# EAGLE design delayed_lfo (EAGLE 7.4.0)

## Sheet 1 of 2
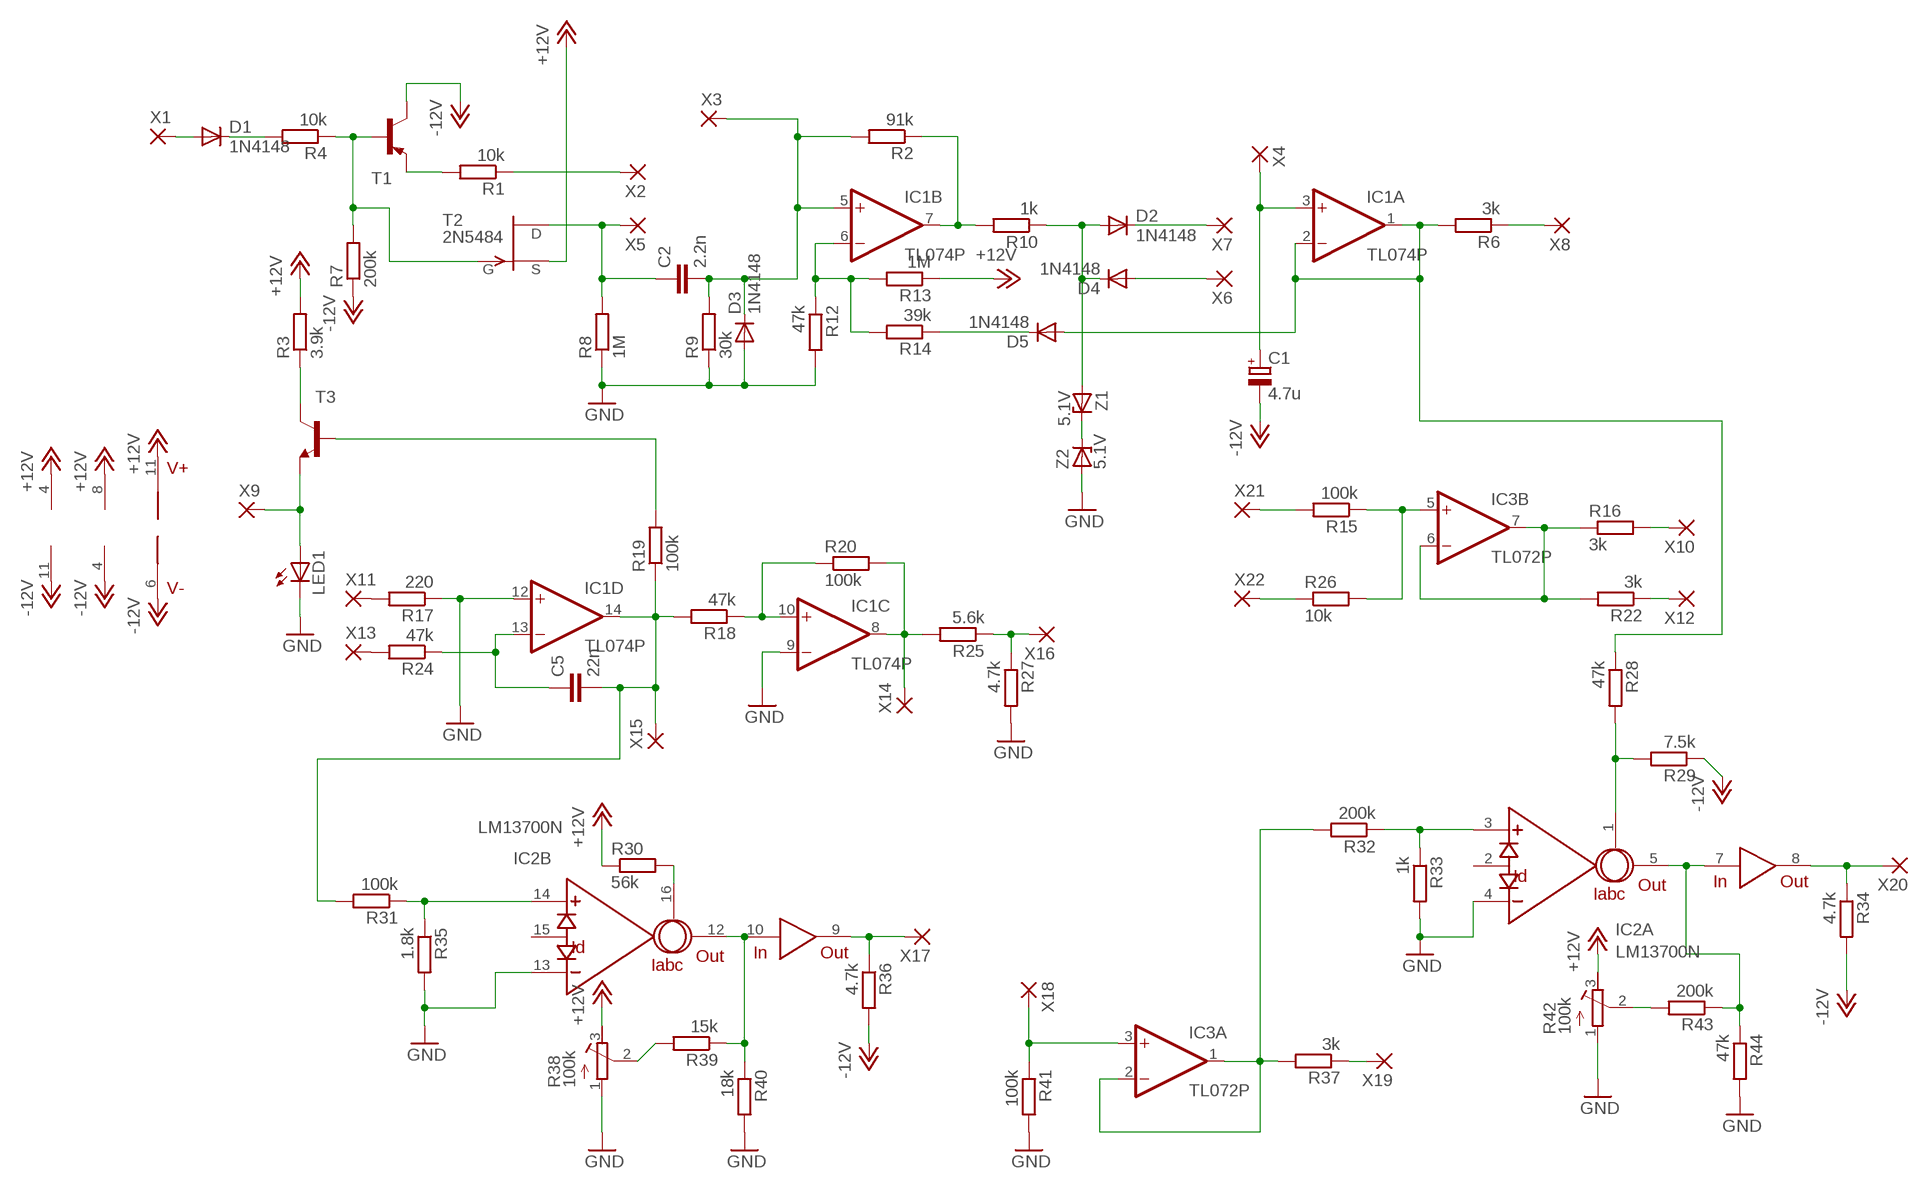
[diagram p0: schematic, sheet 1]

### Parts
C1  4.7u  CPOL-EUE2-5  [E2-5]
C2  2.2n  C-EU050-035X075  [C050-035X075]
C5  22n  C-EU050-035X075  [C050-035X075]
D1  1N4148  1N4148DO35-7  [DO35-7]
D2  1N4148  1N4148DO35-7  [DO35-7]
D3  1N4148  1N4148DO35-7  [DO35-7]
D4  1N4148  1N4148DO35-7  [DO35-7]
D5  1N4148  1N4148DO35-7  [DO35-7]
IC1  TL074P  [DIL14]
IC2  LM13700N  [DIL16]
IC3  TL072P  [DIL08]
LED1  LED5MM  [LED5MM]
R1  10k  R-EU_0309/V  [0309V]
R2  91k  R-EU_0309/V  [0309V]
R3  3.9k  R-EU_0309/V  [0309V]
R4  10k  R-EU_0309/V  [0309V]
R6  3k  R-EU_0309/V  [0309V]
R7  200k  R-EU_0309/V  [0309V]
R8  1M  R-EU_0309/V  [0309V]
R9  30k  R-EU_0309/V  [0309V]
R10  1k  R-EU_0309/V  [0309V]
R12  47k  R-EU_0309/V  [0309V]
R13  1M  R-EU_0309/V  [0309V]
R14  39k  R-EU_0309/V  [0309V]
R15  100k  R-EU_0309/V  [0309V]
R16  3k  R-EU_0309/V  [0309V]
R17  220  R-EU_0309/V  [0309V]
R18  47k  R-EU_0309/10  [0309/10]
R19  100k  R-EU_0309/V  [0309V]
R20  100k  R-EU_0309/V  [0309V]
R22  3k  R-EU_0309/V  [0309V]
R24  47k  R-EU_0309/V  [0309V]
R25  5.6k  R-EU_0309/V  [0309V]
R26  10k  R-EU_0309/V  [0309V]
R27  4.7k  R-EU_0309/V  [0309V]
R28  47k  R-EU_0309/V  [0309V]
R29  7.5k  R-EU_0309/V  [0309V]
R30  56k  R-EU_0309/V  [0309V]
R31  100k  R-EU_0309/V  [0309V]
R32  200k  R-EU_0309/10  [0309/10]
R33  1k  R-EU_0309/V  [0309V]
R34  4.7k  R-EU_0309/10  [0309/10]
R35  1.8k  R-EU_0309/V  [0309V]
R36  4.7k  R-EU_0309/10  [0309/10]
R37  3k  R-EU_0309/V  [0309V]
R38  100k  R-TRIMM64W  [RTRIM64W]
R39  15k  R-EU_0309/10  [0309/10]
R40  18k  R-EU_0309/10  [0309/10]
R41  100k  R-EU_0309/10  [0309/10]
R42  100k  R-TRIMM64W  [RTRIM64W]
R43  200k  R-EU_0309/V  [0309V]
R44  47k  R-EU_0309/V  [0309V]
T1  2N3906-PNP-TO92-EBC  [TO92-EBC]
T2  2N5484  [TO92-]
T3  2N3903-NPN-TO92-BEC  [TO92-BEC]
X1  2,54/1,0  [2,54/1,0]
X2  2,54/1,0  [2,54/1,0]
X3  2,54/1,0  [2,54/1,0]
X4  2,54/1,0  [2,54/1,0]
X5  2,54/1,0  [2,54/1,0]
X6  2,54/1,0  [2,54/1,0]
X7  2,54/1,0  [2,54/1,0]
X8  2,54/1,0  [2,54/1,0]
X9  2,54/1,0  [2,54/1,0]
X10  2,54/1,0  [2,54/1,0]
X11  2,54/1,0  [2,54/1,0]
X12  2,54/1,0  [2,54/1,0]
X13  2,54/1,0  [2,54/1,0]
X14  2,54/1,0  [2,54/1,0]
X15  2,54/1,0  [2,54/1,0]
X16  2,54/1,0  [2,54/1,0]
X17  2,54/1,0  [2,54/1,0]
X18  2,54/1,0  [2,54/1,0]
X19  2,54/1,0  [2,54/1,0]
X20  2,54/1,0  [2,54/1,0]
X21  2,54/1,0  [2,54/1,0]
X22  2,54/1,0  [2,54/1,0]
Z1  5.1V  BZX90  [DO34Z7]
Z2  5.1V  BZX90  [DO34Z7]

### Nets
+12V: IC1.4(P:V+) IC2.11(V+) IC3.8(P:V+) R3.2 R13.1 R30.1 R38.3(E) R42.3(E) T2.2(S) ; also sheet 2
-12V: C1.- IC1.11(P:V-) IC2.6(V-) IC3.4(P:V-) R7.1 R29.1 R34.2 R36.2 T1.C ; also sheet 2
GND: D3.A IC1.9(C:-IN) IC1.12(D:+IN) IC2.4(A:-IN) IC2.13(B:-IN) LED1.K(C) R8.1 R9.1 R12.2 R17.1 R27.2 R33.2 R35.2 R38.1(A) R40.2 R41.2 R42.1(A) R44.2 Z2.A ; also sheet 2
N$1: D1.A X1.1(P)
N$2: R1.1 X2.1(P)
N$3: R4.1 R7.2 T1.B T2.1(G)
N$4: D1.C R4.2
N$5: R1.2 T1.E
N$6: C2.1 R8.2 T2.3(D) X5.1(P)
N$7: R3.1 T3.C
N$8: LED1.A T3.E X9.1(P)
N$9: C5.2 IC1.14(D:OUT) R18.2 R19.1 R31.2 X15.1(P)
N$10: R19.2 T3.B
N$12: R17.2 X11.1(P)
N$13: R24.2 X13.1(P)
N$14: C5.1 IC1.13(D:-IN) R24.1
N$15: IC1.10(C:+IN) R18.1 R20.1
N$16: IC1.8(C:OUT) R20.2 R25.2 X14.1(P)
N$17: R25.1 R27.1 X16.1(P)
N$18: IC3.3(A:+IN) R41.1 X18.1(P)
N$19: IC2.9(OUT) R36.1 X17.1(P)
N$20: IC2.14(B:+IN) R31.1 R35.1
N$21: IC2.10(IN) IC2.12(B:OUT) R39.1 R40.1
N$22: IC2.16(B:IABC) R30.2
N$23: R38.2(S) R39.2
N$24: IC3.1(A:OUT) IC3.2(A:-IN) R32.2 R37.2
N$25: R37.1 X19.1(P)
N$26: IC2.3(A:+IN) R32.1 R33.1
N$28: IC2.5(A:OUT) IC2.7(IN) R43.1 R44.1
N$29: IC2.1(A:IABC) R28.2 R29.2
N$30: R42.2(S) R43.2
N$31: IC2.8(OUT) R34.1 X20.1(P)
N$32: R15.2 X21.1(P)
N$33: IC3.5(B:+IN) R15.1 R26.2
N$34: R26.1 X22.1(P)
N$35: IC3.6(B:-IN) IC3.7(B:OUT) R16.1 R22.2
N$36: R16.2 X10.1(P)
N$37: R22.1 X12.1(P)
N$38: IC1.7(B:OUT) R2.1 R10.2
N$39: C2.2 D3.C IC1.5(B:+IN) R2.2 R9.2 X3.1(P)
N$40: IC1.6(B:-IN) R12.1 R13.2 R14.2
N$41: D5.C R14.1
N$42: D5.A IC1.1(A:OUT) IC1.2(A:-IN) R6.2 R28.1
N$43: R6.1 X8.1(P)
N$44: Z1.C Z2.C
N$45: D2.A D4.C R10.1 Z1.A
N$46: D4.A X6.1(P)
N$47: D2.C X7.1(P)
N$48: C1.+ IC1.3(A:+IN) X4.1(P)
Unconnected: IC2.2(A:ID) IC2.15(B:ID)

## Sheet 2 of 2
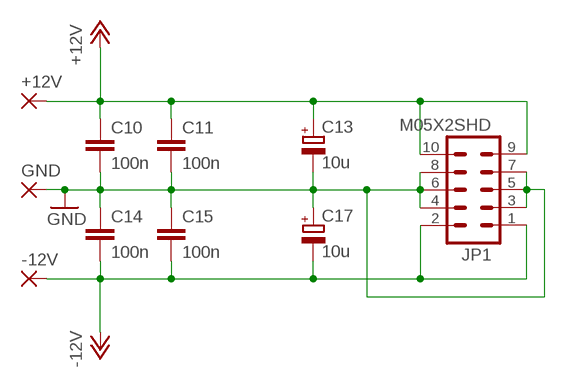
[diagram p1: schematic, sheet 2]

### Parts
+12V  2,54/1,0  [2,54/1,0]
-12V  2,54/1,0  [2,54/1,0]
C10  100n  C-EU050-035X075  [C050-035X075]
C11  100n  C-EU050-035X075  [C050-035X075]
C13  10u  CPOL-EUE3.5-8  [E3,5-8]
C14  100n  C-EU050-035X075  [C050-035X075]
C15  100n  C-EU050-035X075  [C050-035X075]
C17  10u  CPOL-EUE3.5-8  [E3,5-8]
GND  2,54/1,0  [2,54/1,0]
JP1  M05X2SHD  [2X5-SHROUDED]

### Nets
+12V: +12V.1(P) C10.1 C11.1 C13.+ JP1.9 JP1.10 ; also sheet 1
-12V: -12V.1(P) C14.2 C15.2 C17.- JP1.1 JP1.2 ; also sheet 1
GND: C10.2 C11.2 C13.- C14.1 C15.1 C17.+ GND.1(P) JP1.3 JP1.4 JP1.5 JP1.6 JP1.7 JP1.8 ; also sheet 1

## Library data of the parts
+12V -12V GND X1-X22 = wirepad:2,54/1,0: THROUGH-HOLE PAD
C1 C13 C17 = rcl:CPOL-EU: POLARIZED CAPACITOR, European symbol
C2 C5 C10 C11 C14 C15 = rcl:C-EU: CAPACITOR, European symbol
D1-D5 = diode:1N4148: DIODE high speed (Philips)
IC1 = cavalier:TL074: OP AMP
IC2 = synthdiy:LM13700: National Dual OTA with buffers.
IC3 = cavalier:TL072: OP AMP
JP1 = SparkFun:M05X2: Header 5x2 Standard 10-pin dual row 0.1" header. Commonly used with AVR-ISP. Use with Spark Fun Electronics SKU: PRT-00778
LED1 = led:LED: LED OSRAM: - CHIPLED LG R971, LG N971, LY N971, LG Q971, LY Q971, LO R971, LY R971 LH N974, LH R974 LS Q976, LO Q976, LY Q976 LO Q996 - Hyper CHIPLED LW Q18S LB Q993, LB Q99A, LB R99A - SideLED LS A670, LO A670, LY A670, LG A670, LP A670 LB A673, LV A673, LT A673, LW A673 LH A674 LY A675 LS A676, LA A676, LO A676, LY A676, LW A676 LS A679, LY A679, LG A679 - Hyper Micro SIDELED® LS Y876, LA Y876, LO Y876, LY Y876 LT Y87S - SmartLED LW L88C, LW L88S LB L89C, LB L89S, LG L890 LS L89K, LO L89K, LY L89K LS L896, LA L896, LO L896, LY L896 - TOPLED LS T670, LO T670, LY T670, LG T670, LP T670 LSG T670, LSP T670, LSY T670, LOP T670, LYG T670 LG T671, LOG T671, LSG T671 LB T673, LV T673, LT T673, LW T673 LH T674 LS T676, LA T676, LO T676, LY T676, LB T676, LH T676, LSB T676, LW T676 LB T67C, LV T67C, LT T67C, LS T67K, LO T67K, LY T67K, LW E67C LS E67B, LA E67B, LO E67B, LY E67B, LB E67C, LV E67C, LT E67C LW T67C LS T679, LY T679, LG T679 LS T770, LO T770, LY T770, LG T770, LP T770 LB T773, LV T773, LT T773, LW T773 LH T774 LS E675, LA E675, LY E675, LS T675 LS T776, LA T776, LO T776, LY T776, LB T776 LHGB T686 LT T68C, LB T68C - Hyper Mini TOPLED® LB M676 - Mini TOPLED Santana® LG M470 LS M47K, LO M47K, LY M47K Source: http://www.osram.convergy.de LUXEON: - LUMILED® LXK2-PW12-R00, LXK2-PW12-S00, LXK2-PW14-U00, LXK2-PW14-V00 LXK2-PM12-R00, LXK2-PM12-S00, LXK2-PM14-U00 LXK2-PE12-Q00, LXK2-PE12-R00, LXK2-PE12-S00, LXK2-PE14-T00, LXK2-PE14-U00 LXK2-PB12-K00, LXK2-PB12-L00, LXK2-PB12-M00, LXK2-PB14-N00, LXK2-PB14-P00, LXK2-PB14-Q00 LXK2-PR12-L00, LXK2-PR12-M00, LXK2-PR14-Q00, LXK2-PR14-R00 LXK2-PD12-Q00, LXK2-PD12-R00, LXK2-PD12-S00 LXK2-PH12-R00, LXK2-PH12-S00 LXK2-PL12-P00, LXK2-PL12-Q00, LXK2-PL12-R00 Source: www.luxeon.com KINGBRIGHT: KA-3528ASYC Source: www.kingbright.com
R1-R4 R6-R10 R12-R20 R22 R24-R37 R39-R41 R43 R44 = rcl:R-EU_: RESISTOR, European symbol
R38 R42 = rcl:R-TRIMM: Trimm resistor
T1 = transistor-neu-to92:*-PNP-: PNP Transistror
T2 = transistor-fet:?548*: N-Channel JFETs Source: VISHAY 2N5484.pdf Compatible: TO92 2N5245 J304 J305 U310 J308 J309 J310 TO72 2N4416 2N4416A 2N3823 2N4351 3N169 3N170 3N171 MFE3002 TO18 2N3796 2N3797 MFE825 Source: Motorola European Master Guide Pacge 3-59
T3 = transistor-neu-to92:*-NPN-: NPN Transistror
Z1 Z2 = diode:BZX90: Z DIODE

## Board
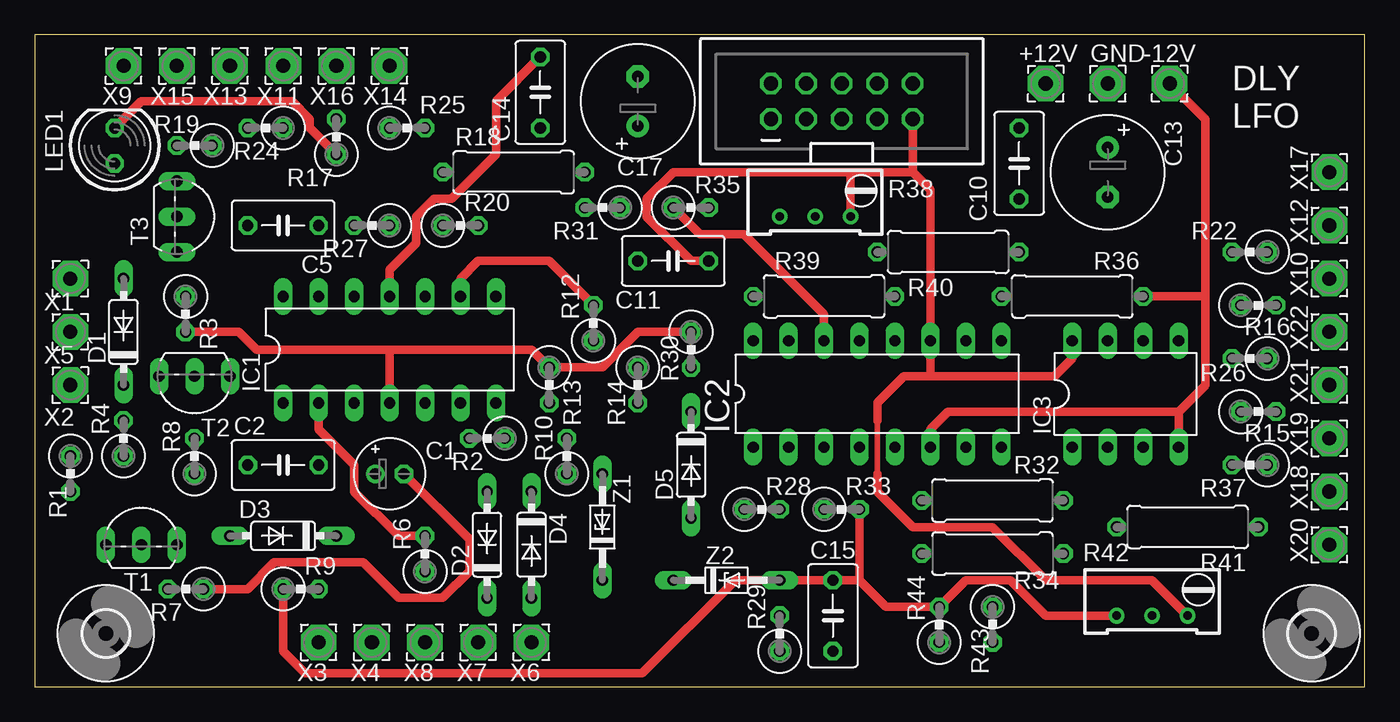
[diagram p2: board, top side]
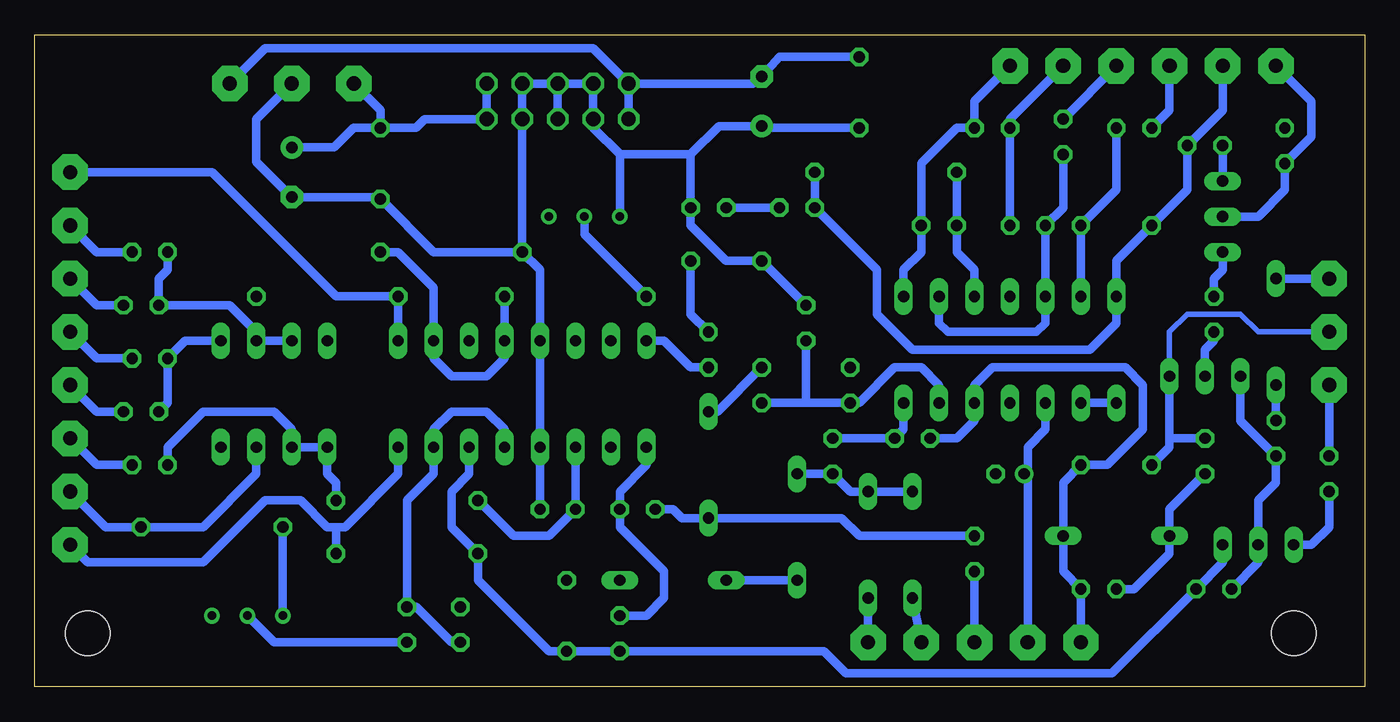
[diagram p3: board, bottom side, seen from below]

Size 95.23 x 46.66 mm. Coordinates in mm from the lower left corner, seen from the top.
Outline: 0,0 95.23,0 95.23,46.66 0,46.66 0,0
Copper layers (1*16): Top 0.035mm / dielectric 1.5mm / Bottom 0.035mm
Design rules "default": minimum track width 10mil, minimum drill 24mil, track to track 8mil, track to pad 8mil, pad to pad 8mil, via to via 8mil, smd to smd 8mil, copper to edge 40mil, drill to drill 8mil, minimum pad ring 10mil, minimum via ring 8mil, stop-mask expansion 4mil, vias tented up to drill 0mil, thermal gap 10mil

### Footprints (pad centres in the part's own frame; a part is rotated, then mirrored left to right if it is on the bottom)
2,54/1,0 = drill 1.016 pad 2.54 octagon: 1 0,0
E2-5 = drill 0.813 pad 1.27: + -1.016,0 | drill 0.813 pad 1.27 octagon: - 1.016,0
C050-035X075 = drill 0.813 octagon: 1 -2.54,0; 2 2.54,0
E3,5-8 = drill 0.813 pad 1.6: + -1.778,0 | drill 0.813 pad 1.6 octagon: - 1.778,0
DO35-7 = drill 0.813 long: A 3.81,0; C -3.81,0
DIL14 = drill 0.813 long: 1 -7.62,-3.81; 2 -5.08,-3.81; 3 -2.54,-3.81; 4 0,-3.81; 5 2.54,-3.81; 6 5.08,-3.81; 7 7.62,-3.81; 8 7.62,3.81; 9 5.08,3.81; 10 2.54,3.81; 11 0,3.81; 12 -2.54,3.81; 13 -5.08,3.81; 14 -7.62,3.81
DIL16 = drill 0.813 long: 1 -8.89,-3.81; 2 -6.35,-3.81; 3 -3.81,-3.81; 4 -1.27,-3.81; 5 1.27,-3.81; 6 3.81,-3.81; 7 6.35,-3.81; 8 8.89,-3.81; 9 8.89,3.81; 10 6.35,3.81; 11 3.81,3.81; 12 1.27,3.81; 13 -1.27,3.81; 14 -3.81,3.81; 15 -6.35,3.81; 16 -8.89,3.81
DIL08 = drill 0.813 pad 1.27 long: 1 -3.81,-3.81; 2 -1.27,-3.81; 3 1.27,-3.81; 4 3.81,-3.81; 5 3.81,3.81; 6 1.27,3.81; 7 -1.27,3.81; 8 -3.81,3.81
2X5-SHROUDED = drill 1.016 octagon: 1 -1.27,5.08; 2 1.27,5.08; 3 -1.27,2.54; 4 1.27,2.54; 5 -1.27,0; 6 1.27,0; 7 -1.27,-2.54; 8 1.27,-2.54; 9 -1.27,-5.08; 10 1.27,-5.08
LED5MM = drill 0.813 octagon: A -1.27,0; K 1.27,0
0309V = drill 0.813 octagon: 1 -1.27,0; 2 1.27,0
0309/10 = drill 0.813 octagon: 1 -5.08,0; 2 5.08,0
RTRIM64W = drill 0.61: 1 1.27,-2.54; 2 1.27,0; 3 1.27,2.54
TO92-EBC = drill 0.813 long: B 0,-1.27; C 2.54,-1.27; E -2.54,-1.27
TO92- = drill 0.813 long: 1 2.54,0; 2 0,0; 3 -2.54,0
TO92-BEC = drill 0.813 long: B -2.54,0; C 2.54,0; E 0,0
3,2 = hole 3.2: 0,0
DO34Z7 = drill 0.813 long: A 3.81,0; C -3.81,0

### Placement (x,y rotation side)
+12V  72.39,43.18 0 top
-12V  81.28,43.18 0 top
C1  25.4,15.24 0 top
C2  17.78,15.88 0 top
C5  17.78,33.02 180 top
C10  70.48,37.47 270 top
C11  45.72,30.48 180 top
C13  76.83,36.83 270 top
C14  36.2,42.55 90 top
C15  57.15,5.08 270 top
C17  43.18,41.91 90 top
D1  6.35,25.4 90 top
D2  32.38,10.16 90 top
D3  17.78,10.79 180 top
D4  35.56,10.16 270 top
D5  46.99,15.88 270 top
GND  76.83,43.18 0 top
IC1  25.4,24.13 0 top
IC2  60.33,20.95 0 top
IC3  78.11,20.95 0 top
JP1  57.78,41.91 90 top
LED1  5.71,38.73 90 top
R1  2.54,15.24 270 top
R2  32.38,17.78 180 top
R3  10.79,26.67 270 top
R4  6.35,17.78 90 top
R6  27.94,9.53 90 top
R7  10.79,6.99 180 top
R8  11.43,16.51 90 top
R9  19.05,6.99 0 top
R10  38.1,16.51 90 top
R12  40.01,26.04 90 top
R13  36.83,21.59 270 top
R14  43.18,21.59 270 top
R15  87.63,19.68 0 top
R16  87.63,27.3 0 top
R17  21.59,39.37 90 top
R18  34.29,36.83 0 top
R19  11.43,38.73 180 top
R20  30.48,33.02 0 top
R22  87,31.11 180 top
R24  16.51,40.01 180 top
R25  26.67,40.01 0 top
R26  87,23.5 180 top
R27  24.13,33.02 180 top
R28  52.07,12.7 0 top
R29  53.34,3.81 90 top
R30  46.99,24.13 270 top
R31  40.64,34.29 180 top
R32  68.58,13.34 0 top
R33  57.78,12.7 0 top
R34  68.58,9.53 180 top
R35  46.99,34.29 0 top
R36  74.3,27.94 0 top
R37  87,15.88 180 top
R38  55.88,34.92 270 top
R39  56.52,27.94 180 top
R40  65.41,31.11 180 top
R41  82.55,11.43 180 top
R42  80.01,6.35 270 top
R43  68.58,4.45 270 top
R44  64.77,4.45 90 top
T1  7.62,11.43 0 top
T2  11.43,22.23 180 top
T3  10.16,33.66 270 top
U$1  [3,2]  5.08,3.81 0 top
U$2  [3,2]  91.44,3.81 0 top
X1  2.54,29.21 0 top
X2  2.54,21.59 0 top
X3  20.32,3.17 90 top
X4  24.13,3.17 90 top
X5  2.54,25.4 90 top
X6  35.56,3.17 90 top
X7  31.75,3.17 90 top
X8  27.94,3.17 90 top
X9  6.35,44.45 90 top
X10  92.71,29.21 90 top
X11  17.78,44.45 90 top
X12  92.71,33.02 90 top
X13  13.97,44.45 90 top
X14  25.4,44.45 90 top
X15  10.16,44.45 90 top
X16  21.59,44.45 90 top
X17  92.71,36.83 90 top
X18  92.71,13.97 90 top
X19  92.71,17.78 90 top
X20  92.71,10.16 90 top
X21  92.71,21.59 90 top
X22  92.71,25.4 90 top
Z1  40.64,11.43 90 top
Z2  49.53,7.62 0 top

### Tracks (layer width: path | path; a pad name or v marks a point on that pad's centre or on a via)
+12V
  Top 0.406: 60.33,15.24 60.33,19.05
  Top 0.61: C11.1 46.99,30.48 43.81,33.66 43.81,34.92 45.72,36.83 58.42,36.83 | R38.3 58.42,36.83 | 62.87,36.83 64.14,35.56 IC2.11 64.14,22.23 | 62.87,36.83 JP1.9 | 58.42,36.83 62.87,36.83 | IC3.8 74.3,23.5 73.03,22.23 64.14,22.23 | R42.3 80.01,7.62 72.39,7.62 68.58,11.43 62.87,11.43 60.33,13.97 60.33,15.24 | 60.33,19.05 60.33,20.32 62.23,22.23 64.14,22.23 | IC1.4 25.4,24.13 | 25.4,24.13 15.88,24.13 14.61,25.4 R3.2 | 25.4,24.13 35.56,24.13 R13.1 40.64,22.86 43.18,25.4 R30.1
  Bottom 0.61: R3.2 10.79,24.77 11.43,24.13 T2.2 | JP1.10 JP1.9 67.31,40.64 67.94,40.01 C10.1 | C11.1 48.26,26.67 R30.1 | +12V.1 70.48,41.27 C10.1 | C13.+ 73.79,38.61 72.39,40.01 C10.1
-12V
  Top 0.61: C1.- 31.11,10.54 31.11,8.26 29.21,6.35 26.04,6.35 23.5,8.89 17.14,8.89 15.24,6.99 R7.1 | 83.82,27.94 83.82,21.59 81.92,19.68 | R36.2 83.82,27.94 | IC1.11 25.4,29.84 27.3,31.75 27.3,33.66 28.57,34.92 29.84,34.92 33.02,38.1 33.02,41.91 C14.2 | 83.82,27.94 83.82,40.64 -12V.1 | IC3.4 81.92,19.68 | 81.92,19.68 65.41,19.68 64.14,18.41 IC2.6
  Bottom 0.61: T1.C 10.16,8.89 R7.1 18.1,0.95 37.15,0.95 38.73,2.54 R29.1 C15.2 58.42,2.54 63.5,7.62 R34.2 65.41,11.43 65.41,13.97 64.14,15.24 IC2.6 | C14.2 41.91,45.09 43.05,43.81 C17.- 43.31,43.81 43.18,43.81 43.81,43.18 JP1.2 | JP1.2 JP1.1 | -12V.1 78.74,45.72 55.24,45.72 JP1.2
GND
  Top 0.61: LED1.K 7.62,41.91 18.41,41.91 19.68,40.64 19.68,40.01 R17.1 | IC1.9 30.48,29.21 31.75,30.48 36.83,30.48 R12.2 | R9.1 17.78,2.54 19.37,0.95 43.5,0.95 50.16,7.62 Z2.A C15.1 59.05,7.62 | 59.05,7.62 60.96,5.71 R44.2 66.67,7.62 69.85,7.62 72.39,5.08 R42.1 | R33.2 59.05,7.62
  Bottom 0.61: R17.1 21.59,34.29 R27.2 IC1.12 22.86,26.04 23.5,25.4 29.84,25.4 30.48,26.04 IC1.9 | R9.1 16.51,6.99 13.97,9.53 D3.A 13.97,12.7 R8.1 | R42.1 R41.2 | JP1.5 JP1.6 | JP1.6 JP1.4 JP1.3 55.24,40.01 53.34,38.1 | JP1.6 JP1.8 JP1.7 R40.2 | C14.1 43.05,40.01 C17.+ 46.23,40.13 48.26,38.1 | 48.26,38.1 53.34,38.1 | 48.26,38.1 R35.2 48.26,33.02 45.72,30.48 C11.2 R12.2 | R38.1 53.34,38.1 | GND.1 79.38,40.64 79.38,37.59 C13.- 70.61,35.05 C10.2 66.67,31.11 R40.2 | R40.2 59.05,29.84 IC2.13 IC2.4 R33.2
N$1
  Bottom 0.61: X1.1 D1.A
N$2
  Bottom 0.61: X2.1 R1.1
N$3
  Bottom 0.61: T2.1 8.89,19.05 R4.1 6.35,14.61 7.62,13.34 T1.B 7.62,8.89 R7.2
N$4
  Bottom 0.61: R4.2 D1.C
N$5
  Bottom 0.61: R1.2 2.54,11.43 3.81,10.16 T1.E
N$6
  Bottom 0.406: X5.1 7.62,25.4 8.89,26.67 12.7,26.67 13.97,25.4 T2.3
  Bottom 0.61: T2.3 13.97,17.78 | 13.97,17.78 13.97,17.14 C2.1 | R8.2 13.97,17.78
N$7
  Bottom 0.61: R3.1 10.79,29.21 10.16,29.84 T3.C
N$8
  Bottom 0.61: X9.1 3.81,41.91 3.81,39.37 LED1.A 5.71,35.56 7.62,33.66 T3.E
N$9
  Bottom 0.61: X15.1 10.16,41.27 R19.1 12.7,35.56 C5.2 17.78,30.48 IC1.14 17.78,26.04 19.68,24.13 32.38,24.13 34.92,26.67 34.92,29.84 R31.2 R18.2
N$10
  Bottom 0.61: T3.B R19.2
N$12
  Bottom 0.61: X11.1 R17.2
N$13
  Bottom 0.61: X13.1 13.97,41.27 R24.2
N$14
  Bottom 0.61: R24.1 17.78,35.56 C5.1 IC1.13
N$15
  Bottom 0.61: R18.1 R20.1 29.21,31.11 27.94,29.84 IC1.10
N$16
  Bottom 0.61: X14.1 27.94,41.91 R25.2 29.21,40.01 31.75,37.47 R20.2 31.75,31.11 33.02,29.84 IC1.8
N$17
  Bottom 0.61: X16.1 25.4,40.64 R25.1 R27.1
N$18
  Bottom 0.61: IC3.3 79.38,15.24 83.19,11.43 R41.1 90.17,11.43 X18.1
N$19
  Bottom 0.61: IC2.9 R36.1 73.66,27.94 82.55,36.83 X17.1
N$20
  Top 0.61: IC2.14 56.52,26.67 50.8,32.38 47.62,32.38 R35.1
  Bottom 0.61: R31.1 R35.1
N$21
  Bottom 0.61: R40.1 69.22,31.11 66.67,28.57 IC2.10 66.67,23.5 65.41,22.23 62.87,22.23 61.59,23.5 IC2.12 R39.1
N$22
  Bottom 0.61: IC2.16 50.16,24.77 48.26,22.86 R30.2
N$23
  Bottom 0.61: R39.2 55.88,32.38 R38.2
N$24
  Bottom 0.61: R32.2 73.66,14.61 74.3,15.24 IC3.1 IC3.2 76.83,18.41 78.11,19.68 83.19,19.68 85.72,17.14 R37.2
N$25
  Bottom 0.61: R37.1 90.81,15.88 X19.1
N$26
  Bottom 0.61: IC2.3 R33.1 58.42,10.79 60.96,10.79 R32.1
N$28
  Bottom 0.61: R44.1 65.41,3.17 67.94,5.71 R43.1 68.58,13.34 66.67,15.24 IC2.7 66.67,18.41 65.41,19.68 62.87,19.68 61.59,18.41 IC2.5
N$29
  Bottom 0.61: R29.2 51.44,5.08 50.16,6.35 50.16,8.26 53.34,11.43 R28.2 53.34,13.97 51.44,15.88 IC2.1
N$30
  Bottom 0.61: R43.2 78.11,3.17 R42.2
N$31
  Bottom 0.61: IC2.8 69.22,15.24 73.03,11.43 73.66,11.43 | X20.1 91.44,8.89 83.19,8.89 78.74,13.34 76.2,13.34 74.3,11.43 73.66,11.43 | R34.1 73.66,11.43
N$32
  Bottom 0.61: R15.2 90.81,19.68 X21.1
N$33
  Bottom 0.61: IC3.5 84.45,24.77 R26.2 85.72,20.32 R15.1
N$34
  Bottom 0.61: R26.1 90.81,23.5 X22.1
N$35
  Bottom 0.61: R22.2 85.72,29.84 86.36,29.21 R16.1 81.28,27.3 79.38,25.4 IC3.6 IC3.7
N$36
  Bottom 0.61: R16.2 90.81,27.3 X10.1
N$37
  Bottom 0.61: R22.1 90.81,31.11 X12.1
N$38
  Bottom 0.61: IC1.7 33.02,18.41 R2.1 R10.2
N$39
  Bottom 0.61: X3.1 R9.2 21.59,8.26 D3.C 21.59,14.61 C2.2 18.41,15.88 15.88,18.41 15.88,21.59 17.14,22.86 26.67,22.86 27.94,21.59 IC1.5 27.94,19.05 29.21,17.78 R2.2
N$40
  Bottom 0.61: IC1.6 30.48,21.59 31.75,22.86 33.66,22.86 36.2,20.32 R13.2 40.01,20.32 | R14.2 40.01,20.32 | R12.1 40.01,20.32
N$41
  Bottom 0.61: R14.1 46.35,19.68 D5.C
N$42
  Top 0.61: R6.2 26.04,10.79 22.86,13.97 22.86,15.88 20.32,18.41 IC1.2
  Bottom 0.61: R28.1 49.53,12.7 48.9,12.06 D5.A 37.47,12.06 36.2,10.79 R6.2 | IC1.1 IC1.2
N$43
  Bottom 0.61: X8.1 R6.1
N$44
  Bottom 0.61: Z2.C Z1.C
N$45
  Bottom 0.61: D2.A D4.C 36.83,13.97 R10.1 Z1.A
N$46
  Bottom 0.61: X6.1 D4.A
N$47
  Bottom 0.61: X7.1 D2.C
N$48
  Bottom 0.61: X4.1 24.13,14.99 C1.+ 24.13,15.49 24.13,17.14 22.86,18.41 IC1.3

### Text on the board
tPlace: DLY / LFO